# EAGLE design usbftdi (EAGLE 9.0.0)
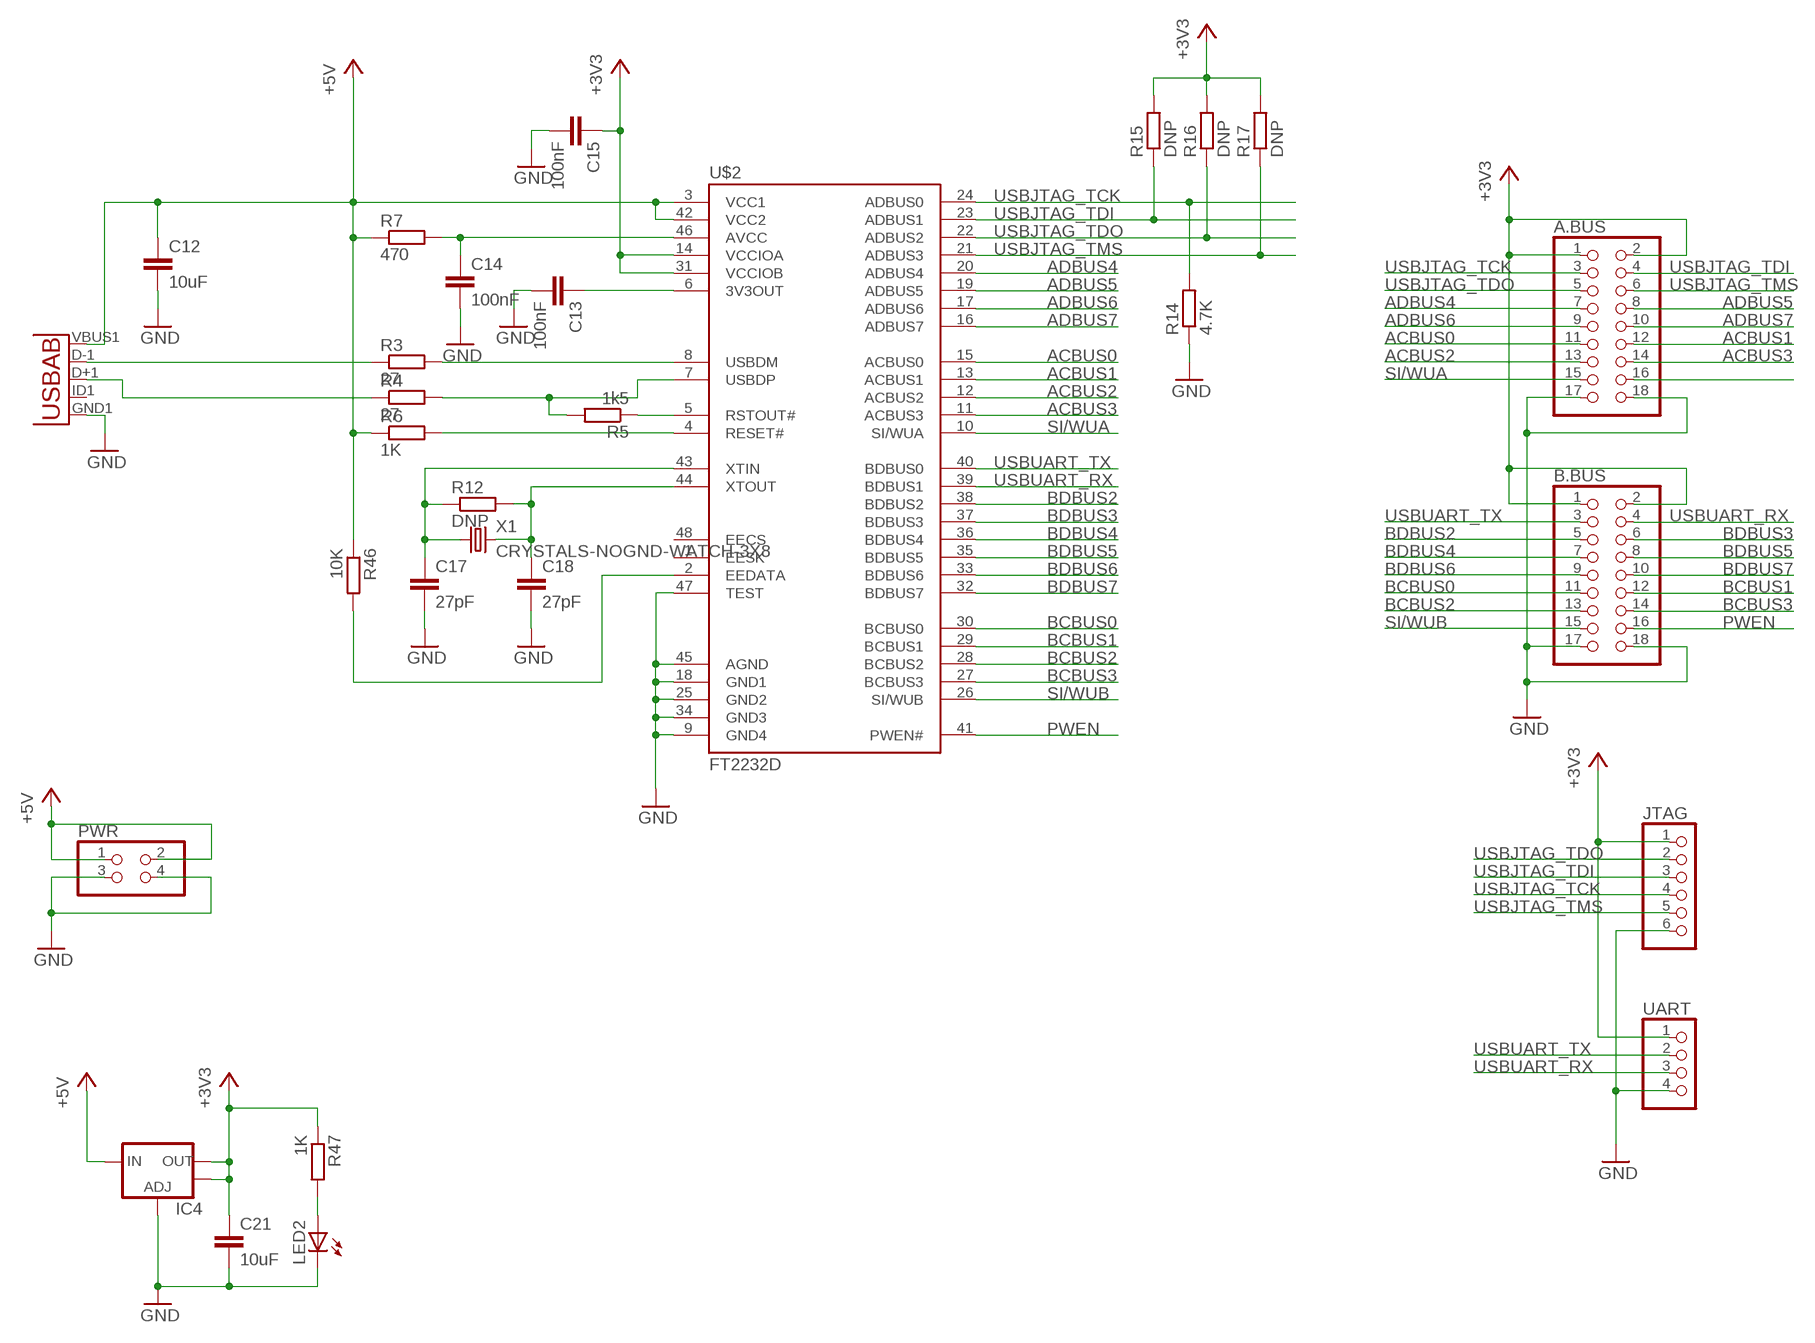
[diagram p0: schematic, sheet 1]

## Parts
A.BUS  PINHD-2X9  [2X09]
B.BUS  PINHD-2X9  [2X09]
C12  10uF  C-EUC0805  [C0805]
C13  100nF  C-EUC0603  [C0603]
C14  100nF  C-EUC0603  [C0603]
C15  100nF  C-EUC0603  [C0603]
C17  27pF  C-EUC0603  [C0603]
C18  27pF  C-EUC0603  [C0603]
C21  10uF  C-EUC0805  [C0805]
IC4  V_REG_LM1117SOT223  [SOT223]
JTAG  PINHD-1X6  [1X06]
LED2  LEDCHIPLED_0603  [CHIPLED_0603]
MICROUSB  USB""  [USB-MICRO-SMD]
PWR  PINHD-2X2  [2X02]
R3  27  R-EU_R0603  [R0603]
R4  27  R-EU_R0603  [R0603]
R5  1k5  R-EU_R0603  [R0603]
R6  1K  R-EU_R0603  [R0603]
R7  470  R-EU_R0603  [R0603]
R12  DNP  R-EU_R0603  [R0603]
R14  4.7K  R-EU_R0603  [R0603]
R15  DNP  R-EU_R0603  [R0603]
R16  DNP  R-EU_R0603  [R0603]
R17  DNP  R-EU_R0603  [R0603]
R46  10K  R-EU_R0603  [R0603]
R47  1K  R-EU_R0603  [R0603]
U$2  FT2232D  [LQFP-48]
UART  PINHD-1X4  [1X04]
X1  CRYSTALS-NOGND-WATCH-3X8  [WATCH-3X8]

## Nets
+3V3: A.BUS.1 A.BUS.2 B.BUS.1 B.BUS.2 C15.1 C21.1 IC4.2(OUT) IC4.4(OUT) JTAG.1 R15.2 R16.2 R17.2 R47.1 U$2.14(VCCIOA) U$2.31(VCCIOB) UART.1
+5V: C12.1 IC4.3(IN) MICROUSB.VBUS1(VBUS) PWR.1 PWR.2 R6.1 R7.1 R46.1 U$2.3(VCC1) U$2.42(VCC2)
ACBUS0: A.BUS.11 U$2.15(ACBUS0)
ACBUS1: A.BUS.12 U$2.13(ACBUS1)
ACBUS2: A.BUS.13 U$2.12(ACBUS2)
ACBUS3: A.BUS.14 U$2.11(ACBUS3)
ADBUS4: A.BUS.7 U$2.20(ADBUS4)
ADBUS5: A.BUS.8 U$2.19(ADBUS5)
ADBUS6: A.BUS.9 U$2.17(ADBUS6)
ADBUS7: A.BUS.10 U$2.16(ADBUS7)
BCBUS0: B.BUS.11 U$2.30(BCBUS0)
BCBUS1: B.BUS.12 U$2.29(BCBUS1)
BCBUS2: B.BUS.13 U$2.28(BCBUS2)
BCBUS3: B.BUS.14 U$2.27(BCBUS3)
BDBUS2: B.BUS.5 U$2.38(BDBUS2)
BDBUS3: B.BUS.6 U$2.37(BDBUS3)
BDBUS4: B.BUS.7 U$2.36(BDBUS4)
BDBUS5: B.BUS.8 U$2.35(BDBUS5)
BDBUS6: B.BUS.9 U$2.33(BDBUS6)
BDBUS7: B.BUS.10 U$2.32(BDBUS7)
GND: A.BUS.17 A.BUS.18 B.BUS.17 B.BUS.18 C12.2 C13.2 C14.2 C15.2 C17.2 C18.2 C21.2 IC4.1(ADJ) JTAG.6 LED2.C MICROUSB.GND1(GND) PWR.3 PWR.4 R14.1 U$2.9(GND4) U$2.18(GND1) U$2.25(GND2) U$2.34(GND3) U$2.45(AGND) U$2.47(TEST) UART.4
N$1: MICROUSB.D-1(D-) R3.1
N$3: MICROUSB.D+1(D+) R4.1
N$7: R3.2 U$2.8(USBDM)
N$8: C13.1 U$2.6(3V3OUT)
N$9: C14.1 R7.2 U$2.46(AVCC)
N$11: R4.2 R5.2 U$2.7(USBDP)
N$13: R5.1 U$2.5(RSTOUT#)
N$14: R6.2 U$2.4(RESET#)
N$17: C17.1 R12.1 U$2.43(XTIN) X1.1
N$18: C18.1 R12.2 U$2.44(XTOUT) X1.2
N$24: A.BUS.16
N$31: R46.2 U$2.2(EEDATA)
N$32: LED2.A R47.2
PWEN: B.BUS.16 U$2.41(PWEN#)
SI/WUA: A.BUS.15 U$2.10(SI/WUA)
SI/WUB: B.BUS.15 U$2.26(SI/WUB)
USBJTAG_TCK: A.BUS.3 JTAG.4 R14.2 U$2.24(ADBUS0)
USBJTAG_TDI: A.BUS.4 JTAG.3 R15.1 U$2.23(ADBUS1)
USBJTAG_TDO: A.BUS.5 JTAG.2 R16.1 U$2.22(ADBUS2)
USBJTAG_TMS: A.BUS.6 JTAG.5 R17.1 U$2.21(ADBUS3)
USBUART_RX: B.BUS.4 U$2.39(BDBUS1) UART.3
USBUART_TX: B.BUS.3 U$2.40(BDBUS0) UART.2
Unconnected: MICROUSB.ID1(USBID) U$2.1(EESK) U$2.48(EECS)

## Library data of the parts
A.BUS B.BUS = pinhead:PINHD-2X9: PIN HEADER
C12-C15 C17 C18 C21 = resistor:C-EU: CAPACITOR, European symbol
IC4 = SparkFun:V_REG_LM1117: Voltage Regulator LM1117 Standard adjustable voltage regulator but in SMD form. Spark Fun Electronics SKU : COM-00595
JTAG = pinhead:PINHD-1X6: PIN HEADER
LED2 = led:LED: LED OSRAM: - CHIPLED LG R971, LG N971, LY N971, LG Q971, LY Q971, LO R971, LY R971 LH N974, LH R974 LS Q976, LO Q976, LY Q976 LO Q996 - Hyper CHIPLED LW Q18S LB Q993, LB Q99A, LB R99A - SideLED LS A670, LO A670, LY A670, LG A670, LP A670 LB A673, LV A673, LT A673, LW A673 LH A674 LY A675 LS A676, LA A676, LO A676, LY A676, LW A676 LS A679, LY A679, LG A679 - Hyper Micro SIDELED® LS Y876, LA Y876, LO Y876, LY Y876 LT Y87S - SmartLED LW L88C, LW L88S LB L89C, LB L89S, LG L890 LS L89K, LO L89K, LY L89K LS L896, LA L896, LO L896, LY L896 - TOPLED LS T670, LO T670, LY T670, LG T670, LP T670 LSG T670, LSP T670, LSY T670, LOP T670, LYG T670 LG T671, LOG T671, LSG T671 LB T673, LV T673, LT T673, LW T673 LH T674 LS T676, LA T676, LO T676, LY T676, LB T676, LH T676, LSB T676, LW T676 LB T67C, LV T67C, LT T67C, LS T67K, LO T67K, LY T67K, LW E67C LS E67B, LA E67B, LO E67B, LY E67B, LB E67C, LV E67C, LT E67C LW T67C LS T679, LY T679, LG T679 LS T770, LO T770, LY T770, LG T770, LP T770 LB T773, LV T773, LT T773, LW T773 LH T774 LS E675, LA E675, LY E675, LS T675 LS T776, LA T776, LO T776, LY T776, LB T776 LHGB T686 LT T68C, LB T68C - Hyper Mini TOPLED® LB M676 - Mini TOPLED Santana® LG M470 LS M47K, LO M47K, LY M47K Source: http://www.osram.convergy.de LUXEON: - LUMILED® LXK2-PW12-R00, LXK2-PW12-S00, LXK2-PW14-U00, LXK2-PW14-V00 LXK2-PM12-R00, LXK2-PM12-S00, LXK2-PM14-U00 LXK2-PE12-Q00, LXK2-PE12-R00, LXK2-PE12-S00, LXK2-PE14-T00, LXK2-PE14-U00 LXK2-PB12-K00, LXK2-PB12-L00, LXK2-PB12-M00, LXK2-PB14-N00, LXK2-PB14-P00, LXK2-PB14-Q00 LXK2-PR12-L00, LXK2-PR12-M00, LXK2-PR14-Q00, LXK2-PR14-R00 LXK2-PD12-Q00, LXK2-PD12-R00, LXK2-PD12-S00 LXK2-PH12-R00, LXK2-PH12-S00 LXK2-PL12-P00, LXK2-PL12-Q00, LXK2-PL12-R00 Source: www.luxeon.com KINGBRIGHT: KA-3528ASYC Source: www.kingbright.com
MICROUSB = MicroUSB:USB: This is a USB AB connector that is compatible with USB OTG. i.e. this connector can serve as a host or device
PWR = pinhead:PINHD-2X2: PIN HEADER
R3-R7 R12 R14-R17 R46 R47 = resistor:R-EU_: RESISTOR, European symbol
U$2 = SparkFun:FT2232D
UART = pinhead:PINHD-1X4: PIN HEADER
X1 = IQD-Frequency-Products:CRYSTALS-NOGND: CRYSTALS CAN NOT GROUNDED

## Board
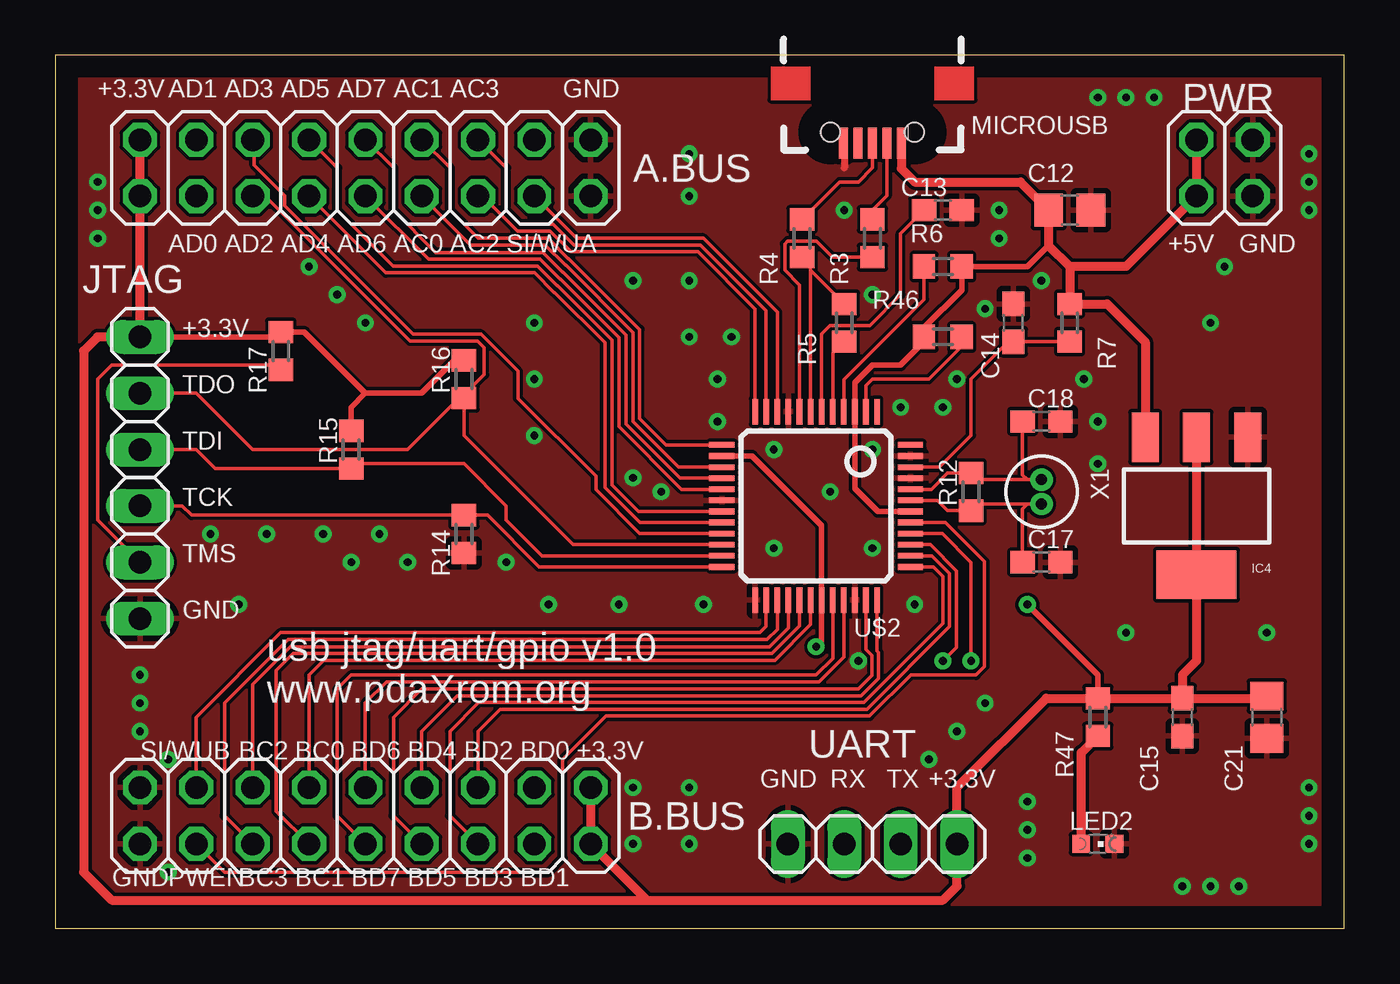
[diagram p1: board, top side]
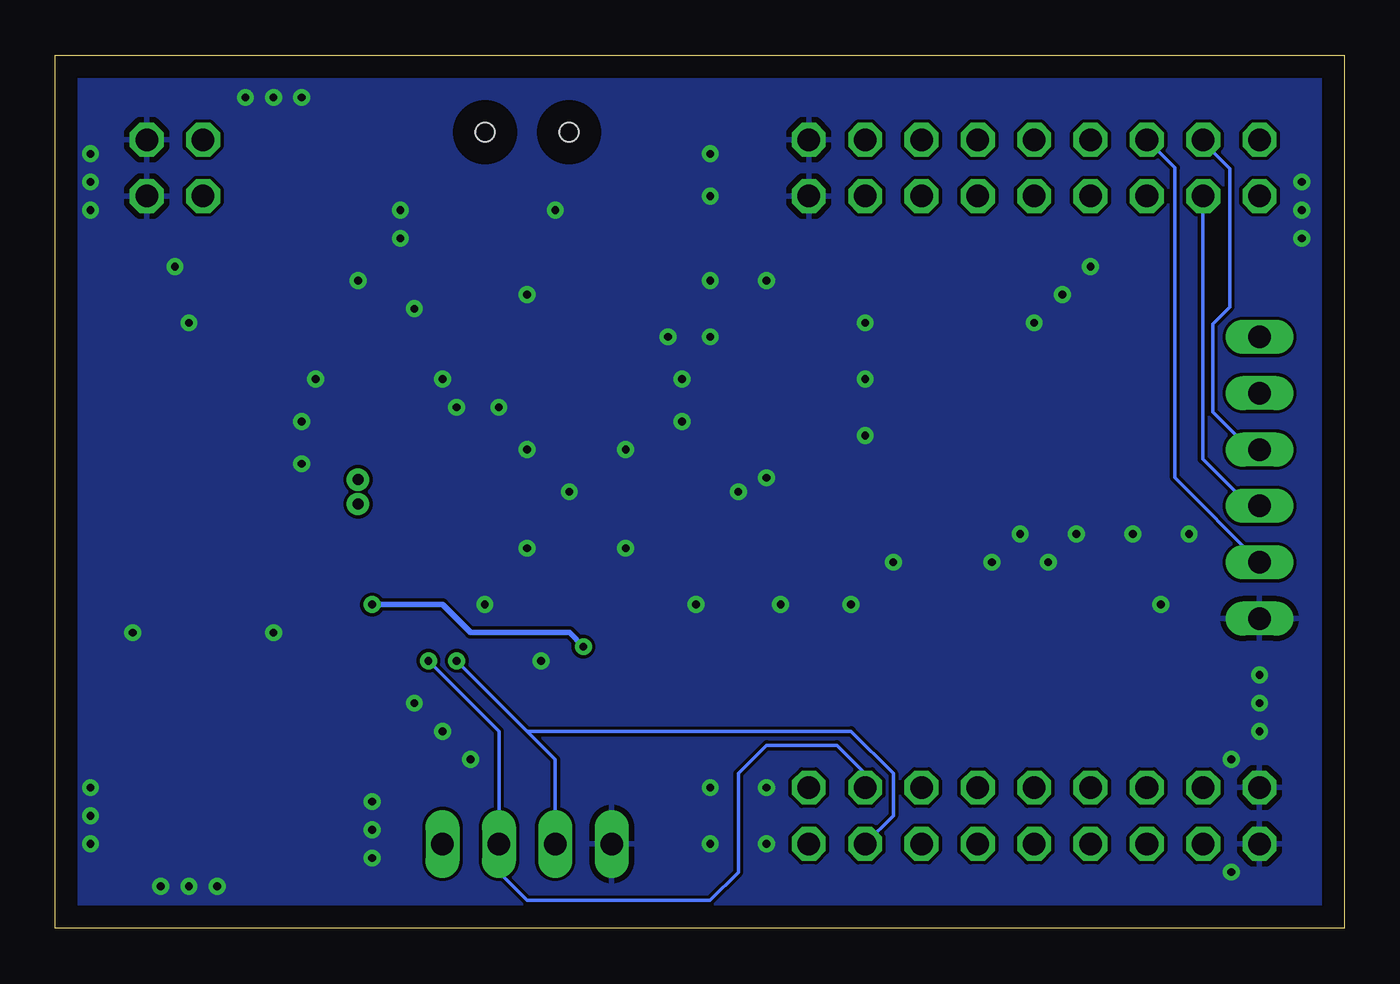
[diagram p2: board, bottom side, seen from below]

Size 58.09 x 39.36 mm. Coordinates in mm from the lower left corner, seen from the top.
Outline: 0,0 58.09,0 58.09,39.36 0,39.36 0,0
Copper layers (1*16): Top 0.035mm / dielectric 1.5mm / Bottom 0.035mm
Design rules "default *": minimum track width 6mil, minimum drill 0.35mm, track to track 6mil, track to pad 6mil, pad to pad 6mil, via to via 6mil, smd to smd 6mil, copper to edge 40mil, drill to drill 6mil, minimum pad ring 10mil, minimum via ring 8mil, stop-mask expansion 4mil, vias tented up to drill 23mil, thermal gap 10mil

### Footprints (pad centres in the part's own frame; a part is rotated, then mirrored left to right if it is on the bottom)
2X09 = drill 1.016 octagon: 1 -10.16,-1.27; 2 -10.16,1.27; 3 -7.62,-1.27; 4 -7.62,1.27; 5 -5.08,-1.27; 6 -5.08,1.27; 7 -2.54,-1.27; 8 -2.54,1.27; 9 0,-1.27; 10 0,1.27; 11 2.54,-1.27; 12 2.54,1.27; 13 5.08,-1.27; 14 5.08,1.27; 15 7.62,-1.27; 16 7.62,1.27; 17 10.16,-1.27; 18 10.16,1.27
C0805 = smd 1.3 x 1.5: 1 -0.95,0; 2 0.95,0
C0603 = smd 1.1 x 1: 1 -0.85,0; 2 0.85,0
SOT223 = smd 1.219 x 2.235: 1 -2.311,-3.099; 2 0,-3.099; 3 2.311,-3.099 | smd 3.6 x 2.2: 4 0,3.099
1X06 = drill 1.016 long: 1 -6.35,0; 2 -3.81,0; 3 -1.27,0; 4 1.27,0; 5 3.81,0; 6 6.35,0
CHIPLED_0603 = smd 0.8 x 0.8: A 0,-0.75; C 0,0.75
USB-MICRO-SMD = smd 1.4 x 0.4: D+1 2.7,0; D-1 2.7,0.65; GND1 2.7,-1.3; ID1 2.7,-0.65; VBUS1 2.7,1.3 | hole 0.85: 2.2,1.9; 2.2,-1.9
2X02 = drill 1.016 octagon: 1 -1.27,-1.27; 2 -1.27,1.27; 3 1.27,-1.27; 4 1.27,1.27
R0603 = smd 1 x 1.1: 1 -0.85,0; 2 0.85,0
LQFP-48 = smd 0.254 x 1.143: 1 -2.75,-4.25; 2 -2.25,-4.25; 3 -1.75,-4.25; 4 -1.25,-4.25; 5 -0.75,-4.25; 6 -0.25,-4.25; 7 0.25,-4.25; 8 0.75,-4.25; 9 1.25,-4.25; 10 1.75,-4.25; 11 2.25,-4.25; 12 2.75,-4.25; 25 2.75,4.25; 26 2.25,4.25; 27 1.75,4.25; 28 1.25,4.25; 29 0.75,4.25; 30 0.25,4.25; 31 -0.25,4.25; 32 -0.75,4.25; 33 -1.25,4.25; 34 -1.75,4.25; 35 -2.25,4.25; 36 -2.75,4.25 | smd 1.143 x 0.254: 13 4.25,-2.75; 14 4.25,-2.25; 15 4.25,-1.75; 16 4.25,-1.25; 17 4.25,-0.75; 18 4.25,-0.25; 19 4.25,0.25; 20 4.25,0.75; 21 4.25,1.25; 22 4.25,1.75; 23 4.25,2.25; 24 4.25,2.75; 37 -4.25,2.75; 38 -4.25,2.25; 39 -4.25,1.75; 40 -4.25,1.25; 41 -4.25,0.75; 42 -4.25,0.25; 43 -4.25,-0.25; 44 -4.25,-0.75; 45 -4.25,-1.25; 46 -4.25,-1.75; 47 -4.25,-2.25; 48 -4.25,-2.75
1X04 = drill 1.016 long: 1 -3.81,0; 2 -1.27,0; 3 1.27,0; 4 3.81,0
WATCH-3X8 = drill 0.5 pad 0.9: 1 -0.55,0; 2 0.55,0

### Placement (x,y rotation side)
A.BUS  13.97,34.29 0 top
B.BUS  13.97,5.08 180 top
C12  45.72,32.38 0 top
C13  40.01,32.38 0 top
C14  43.18,27.3 90 top
C15  50.8,9.53 270 top
C17  44.45,16.51 0 top
C18  44.45,22.86 0 top
C21  54.61,9.53 270 top
IC4  51.44,19.05 180 top
JTAG  3.81,20.32 270 top
LED2  46.99,3.81 270 top
MICROUSB  36.83,38.1 270 top
PWR  52.7,34.29 0 top
R3  36.83,31.11 270 top
R4  33.66,31.11 270 top
R5  35.56,27.3 90 top
R6  40.01,29.84 180 top
R7  45.72,27.3 270 top
R12  41.27,19.68 90 top
R14  18.41,17.78 90 top
R15  13.34,21.59 90 top
R16  18.41,24.77 90 top
R17  10.16,26.04 90 top
R46  40.01,26.67 0 top
R47  46.99,9.53 270 top
U$2  34.29,19.05 180 top
UART  36.83,3.81 180 top
X1  44.45,19.68 90 top

### Tracks (layer width: path | path; a pad name or v marks a point on that pad's centre or on a via)
+3V3  (via drill 0.35)
  Top 0.254: U$2.14 31.41,21.3 34.54,18.16 U$2.31 34.54,12.95 v34.29,12.7 | v43.81,14.61 46.99,11.43 R47.1 | R15.2 13.34,23.5 13.97,24.13 | 13.97,24.13 16.51,24.13 18,25.61 R16.2 | JTAG.1 9.95,26.67 R17.2 11.21,26.89 13.97,24.13
  Top 0.406: IC4.2 IC4.4 51.44,12.06 50.8,11.43 C15.1 | C15.1 R47.1 44.66,10.38 40.64,6.35 UART.1 40.64,1.91 40.01,1.27 26.67,1.27 | C15.1 54.51,10.38 C21.1 | B.BUS.1 B.BUS.2 26.67,1.27 | 26.67,1.27 2.54,1.27 1.27,2.54 1.27,26.04 1.91,26.67 JTAG.1 A.BUS.1 A.BUS.2
  Bottom 0.254: v34.29,12.7 34.92,13.34 39.37,13.34 40.64,14.61 v43.81,14.61
+5V
  Top 0.254: U$2.42 37.08,18.8 36.04,19.84 U$2.3 36.04,24.61 36.83,25.4 38.1,25.4 39.16,26.45 R46.1 39.16,27.09 40.85,28.79 R6.1 43.82,29.84 44.77,30.8
  Top 0.406: MICROUSB.VBUS1 38.13,34.26 38.73,33.66 43.5,33.66 C12.1 44.77,30.8 45.72,29.84 | 45.72,29.84 R7.1 47.41,28.16 49.12,26.44 IC4.3 | PWR.2 PWR.1 48.26,29.84 45.72,29.84
ACBUS0
  Top 0.152: U$2.15 28.09,20.8 26.04,22.86 26.04,26.87 23.01,29.9 22.99,29.9 22.08,30.81 18.72,30.81 A.BUS.11
ACBUS1
  Top 0.152: A.BUS.12 17.78,34.29 17.78,32.38 19.05,31.11 22.2,31.11 23.12,30.2 23.14,30.2 26.34,27 26.34,22.99 27.53,21.8 U$2.13
ACBUS2
  Top 0.152: U$2.12 31.54,27.92 28.96,30.5 23.24,30.5 22.3,31.45 20.83,31.45 19.25,33.02 A.BUS.13
ACBUS3
  Top 0.152: U$2.11 32.04,27.85 29.08,30.81 23.37,30.81 22.43,31.75 20.95,31.75 20.32,32.38 20.32,34.29 A.BUS.14
ADBUS4
  Top 0.152: U$2.20 26.35,18.3 24.77,19.89 24.77,26.42 22.51,28.68 22.48,28.68 21.6,29.57 14.88,29.57 A.BUS.7
ADBUS5
  Top 0.152: U$2.19 26.29,18.8 25.09,19.99 25.09,26.52 22.63,28.98 22.61,28.98 21.72,29.87 15.21,29.87 12.7,32.38 12.7,34.29 A.BUS.8
ADBUS6
  Top 0.152: U$2.17 28.23,19.8 25.4,22.63 25.4,26.65 22.76,29.29 22.74,29.29 21.85,30.18 16.82,30.18 A.BUS.9
ADBUS7
  Top 0.152: U$2.16 28.16,20.3 25.73,22.73 25.73,26.75 22.89,29.59 22.86,29.59 21.98,30.48 17.14,30.48 15.24,32.38 15.24,34.29 A.BUS.10
BCBUS0
  Top 0.152: U$2.30 34.04,13.7 32.43,12.09 12.09,12.09 11.43,11.43 B.BUS.11
BCBUS1
  Top 0.152: U$2.29 33.54,13.63 32.31,12.39 10.72,12.39 9.96,11.63 9.96,5.28 B.BUS.12
BCBUS2
  Top 0.152: U$2.28 33.04,13.56 32.18,12.7 10.59,12.7 8.89,11 B.BUS.13
BCBUS3
  Top 0.152: U$2.27 32.54,13.49 32.08,13.03 10.49,13.03 7.62,10.16 7.62,5.08 B.BUS.14
BDBUS2
  Top 0.152: U$2.38 39.51,16.8 40.31,16 40.31,13.62 36.57,9.88 20.04,9.88 19.05,8.89 B.BUS.5
BDBUS3
  Top 0.152: U$2.37 39.58,16.3 40.01,15.88 40.01,13.74 36.45,10.19 19.07,10.19 17.78,8.89 17.78,5.08 B.BUS.6
BDBUS4
  Top 0.152: U$2.36 37.04,12.51 37.11,12.44 37.11,11.28 36.32,10.49 18.11,10.49 16.51,8.89 B.BUS.7
BDBUS5
  Top 0.152: U$2.35 36.54,12.58 36.8,12.32 36.8,11.4 36.2,10.79 16.51,10.79 15.24,9.53 15.24,5.08 B.BUS.8
BDBUS6
  Top 0.152: U$2.33 35.54,12.25 34.42,11.12 14.94,11.12 13.97,10.16 B.BUS.9
BDBUS7
  Top 0.152: U$2.32 35.04,12.18 34.29,11.43 13.34,11.43 12.7,10.79 12.7,5.08 B.BUS.10
GND  (via drill 0.35)
  Top 0.305: MICROUSB.GND1 35.56,35.4 35.56,34.29
  other vias: 38.1,23.5 40.01,23.5 40.64,24.77 42.55,32.38 42.55,31.11 35.56,32.38 36.83,28.57 41.91,27.94 44.45,29.21 46.35,24.77 46.99,22.86 46.99,20.95 32.38,21.59 32.38,17.14 34.92,19.68 36.83,17.14 36.83,21.59 36.2,12.06 38.73,14.61 27.3,19.68 26.04,20.32 6.99,17.78 9.53,17.78 12.06,17.78 13.34,16.51 14.61,17.78 15.88,16.51 20.32,16.51 1.91,33.66 1.91,32.38 1.91,31.11 3.81,11.43 3.81,10.16 3.81,8.89 46.99,37.47 48.26,37.47 49.53,37.47 56.52,34.92 56.52,33.66 56.52,32.38 56.52,6.35 56.52,5.08 56.52,3.81 53.34,1.91 52.07,1.91 50.8,1.91 11.43,29.84 12.7,28.57 13.97,27.3 21.59,27.3 21.59,24.77 21.59,22.23 8.26,14.61 22.23,14.61 25.4,14.61 29.21,14.61 29.84,22.86 29.84,24.77 30.48,26.67 28.57,26.67 26.04,29.21 28.57,29.21 28.57,33.02 28.57,34.92 28.57,6.35 28.57,3.81 48.26,13.34 54.61,13.34 52.7,29.84 52.07,27.3 5.08,7.62 5.08,2.54 26.04,6.35 26.04,3.81 39.37,7.62 40.64,8.89 41.91,10.16 43.81,5.71 43.81,4.45 43.81,3.17
  pour Top: 0,39.37 58.42,39.37 58.42,0 0,0
  pour Bottom: 0,0 58.42,0 58.42,39.37 0,39.37
N$1
  Top 0.152: MICROUSB.D-1 37.48,33.03 36.83,32.38 R3.1
N$3
  Top 0.152: MICROUSB.D+1 36.83,34.29 36.2,33.66 35.34,33.66 R4.1
N$7
  Top 0.152: R3.2 35.03,30.27 34.3,30.99 33.01,30.99 32.88,30.86 32.88,29.67 33.54,29.01 U$2.8
N$8
  Top 0.152: U$2.6 34.54,26.81 34.91,27.18 36.71,27.18 38.1,28.57 38.1,31.33 C13.1
N$9
  Top 0.152: U$2.46 39.85,20.8 41.27,22.23 41.27,24.77 42.97,26.45 C14.1 R7.2
N$11
  Top 0.152: U$2.7 34.04,29.68 | R4.2 34.04,29.88 34.04,29.68 | R5.2 34.04,29.68
N$13
  Top 0.152: U$2.5 35.04,25.93 R5.1
N$14
  Top 0.152: U$2.4 35.54,24.75 39.16,28.36 R6.2
N$17
  Top 0.152: U$2.43 39.76,19.3 40.22,18.84 R12.1 41.58,19.14 43.81,19.14 | 43.81,19.14 X1.1 | C17.1 43.6,18.92 43.81,19.14
N$18
  Top 0.152: U$2.44 39.48,19.8 40.22,20.54 R12.2 41.58,20.23 43.81,20.23 | 43.81,20.23 X1.2 | C18.1 43.6,20.45 43.81,20.23
N$31
  Top 0.152: U$2.2 36.54,24.48 36.83,24.77 39.37,24.77 40.85,26.25 R46.2
N$32
  Top 0.406: LED2.A 46.24,7.92 R47.2
PWEN
  Top 0.152: B.BUS.16 7.62,2.54 22.23,2.54 22.86,3.17 22.86,7.62 24.82,9.58 36.7,9.58 38.55,11.43 41.5,11.43 41.88,11.81 41.88,16.54 40.12,18.3 U$2.41
SI/WUA
  Top 0.152: U$2.10 32.54,27.79 29.21,31.11 23.5,31.11 A.BUS.15
SI/WUB
  Top 0.152: U$2.26 32.04,13.62 31.75,13.34 10.16,13.34 6.35,9.53 B.BUS.15
USBJTAG_TCK
  Top 0.152: U$2.24 21.8,16.3 19.47,18.63 R14.2 6.13,18.63 5.71,19.05 JTAG.4
  Bottom 0.152: A.BUS.3 6.38,32.89 6.38,21.16 4.39,19.18 3.94,19.18 JTAG.4
USBJTAG_TDI
  Top 0.152: U$2.23 21.93,16.8 20.32,18.41 20.32,19.05 18.41,20.95 13.55,20.95 R15.1 7.2,20.74 6.35,21.59 JTAG.3
  Bottom 0.152: A.BUS.4 6.22,35.48 5.92,35.18 5.92,35.03 5.16,34.27 5.16,28.02 5.92,27.25 5.92,23.29 4.24,21.61 3.94,21.61 JTAG.3
USBJTAG_TDO
  Top 0.152: U$2.22 23.34,17.3 18.41,22.23 R16.1 | R16.1 18.2,23.91 15.88,21.59 8.89,21.59 6.35,24.13 JTAG.2 | A.BUS.5 8.97,32.89 9.58,32.89 15.98,26.49 19.02,26.49 19.33,26.19 19.33,24.97 18.41,24.05 R16.1
USBJTAG_TMS
  Top 0.152: JTAG.5 1.91,18.41 1.91,24.77 2.54,25.4 9.95,25.4 R17.1 | A.BUS.6 8.97,35.48 8.97,34.42 10.34,33.05 10.34,32.59 16.13,26.8 19.18,26.8 20.85,25.12 20.85,23.9 24.36,20.4 24.36,19.79 26.34,17.8 30,17.8 U$2.21
  Bottom 0.152: JTAG.5 7.62,20.32 7.62,34.29 A.BUS.6
USBUART_RX  (via drill 0.35)
  Top 0.152: U$2.39 39.44,17.3 40.62,16.13 40.62,12.68 v40.01,12.06
  Bottom 0.152: v40.01,12.06 36.83,8.89 | 36.83,8.89 35.56,7.62 UART.3 | 36.83,8.89 22.23,8.89 20.32,6.99 20.32,5.08 B.BUS.4
USBUART_TX  (via drill 0.35)
  Top 0.152: U$2.40 39.98,17.8 41.27,16.51 v41.27,12.06
  Bottom 0.152: v41.27,12.06 38.1,8.89 UART.2 38.1,2.54 36.83,1.27 28.57,1.27 27.3,2.54 27.3,6.99 26.04,8.26 22.86,8.26 21.59,6.99 B.BUS.3

### Text on the board
tPlace: +3.3V | AD1 | AD3 | AD5 | AD7 | AC1 | AC3 | GND | AD0 | AD2 | AD4 | AD6 | AC0 | AC2 | SI/WUA | +5V | GND | +3.3V | TDO | TDI | TCK | TMS | GND | usb jtag/uart/gpio v1.0 / www.pdaXrom.org | SI/WUB | BC2 | BC0 | BD6 | BD4 | BD2 | BD0 | +3.3V | GND | RX | TX | +3.3V | GND | PWEN | BC3 | BC1 | BD7 | BD5 | BD3 | BD1